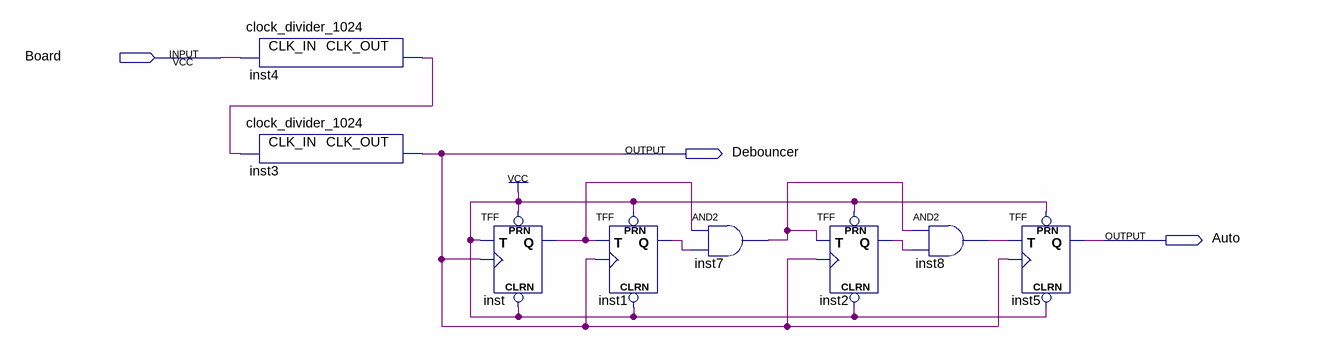
[diagram p0: schematic sheet]
// Quartus schematic debouncer.bdf as structural Verilog: 8 symbols, 3 pins
module debouncer (
  input  Board,
  output Debouncer,
  output Auto
);

  wire inst1_q, inst2_q, inst4_clk_out, inst7_out, inst8_out, inst_q;

  clock_divider_1024 inst4 (.CLK_IN(Board), .CLK_OUT(inst4_clk_out));
  clock_divider_1024 inst3 (.CLK_IN(inst4_clk_out), .CLK_OUT(Debouncer));
  TFF inst (.PRN(1'b1), .CLRN(1'b1), .T(1'b1), .CLK(Debouncer), .Q(inst_q));
  TFF inst1 (.PRN(1'b1), .CLRN(1'b1), .T(inst_q), .CLK(Debouncer), .Q(inst1_q));
  and inst7 (inst7_out, inst_q, inst1_q);
  TFF inst2 (.PRN(1'b1), .CLRN(1'b1), .T(inst7_out), .CLK(Debouncer), .Q(inst2_q));
  and inst8 (inst8_out, inst7_out, inst2_q);
  TFF inst5 (.PRN(1'b1), .CLRN(1'b1), .T(inst8_out), .CLK(Debouncer), .Q(Auto));
endmodule
